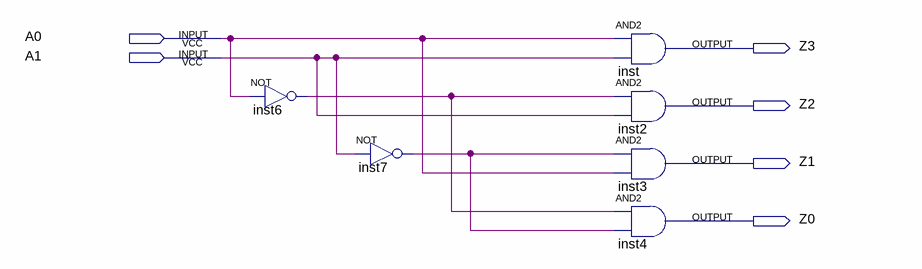
[diagram p0: schematic sheet]
// Quartus schematic two.bdf as structural Verilog: 6 symbols, 6 pins
module two (
  input  A0,
  input  A1,
  output Z3,
  output Z2,
  output Z1,
  output Z0
);

  wire inst6_out, inst7_out;

  not inst6 (inst6_out, A0);
  not inst7 (inst7_out, A1);
  and inst (Z3, A0, A1);
  and inst2 (Z2, inst6_out, A1);
  and inst3 (Z1, inst7_out, A0);
  and inst4 (Z0, inst6_out, inst7_out);
endmodule
